# Altium project 智能车主板.PrjPcb
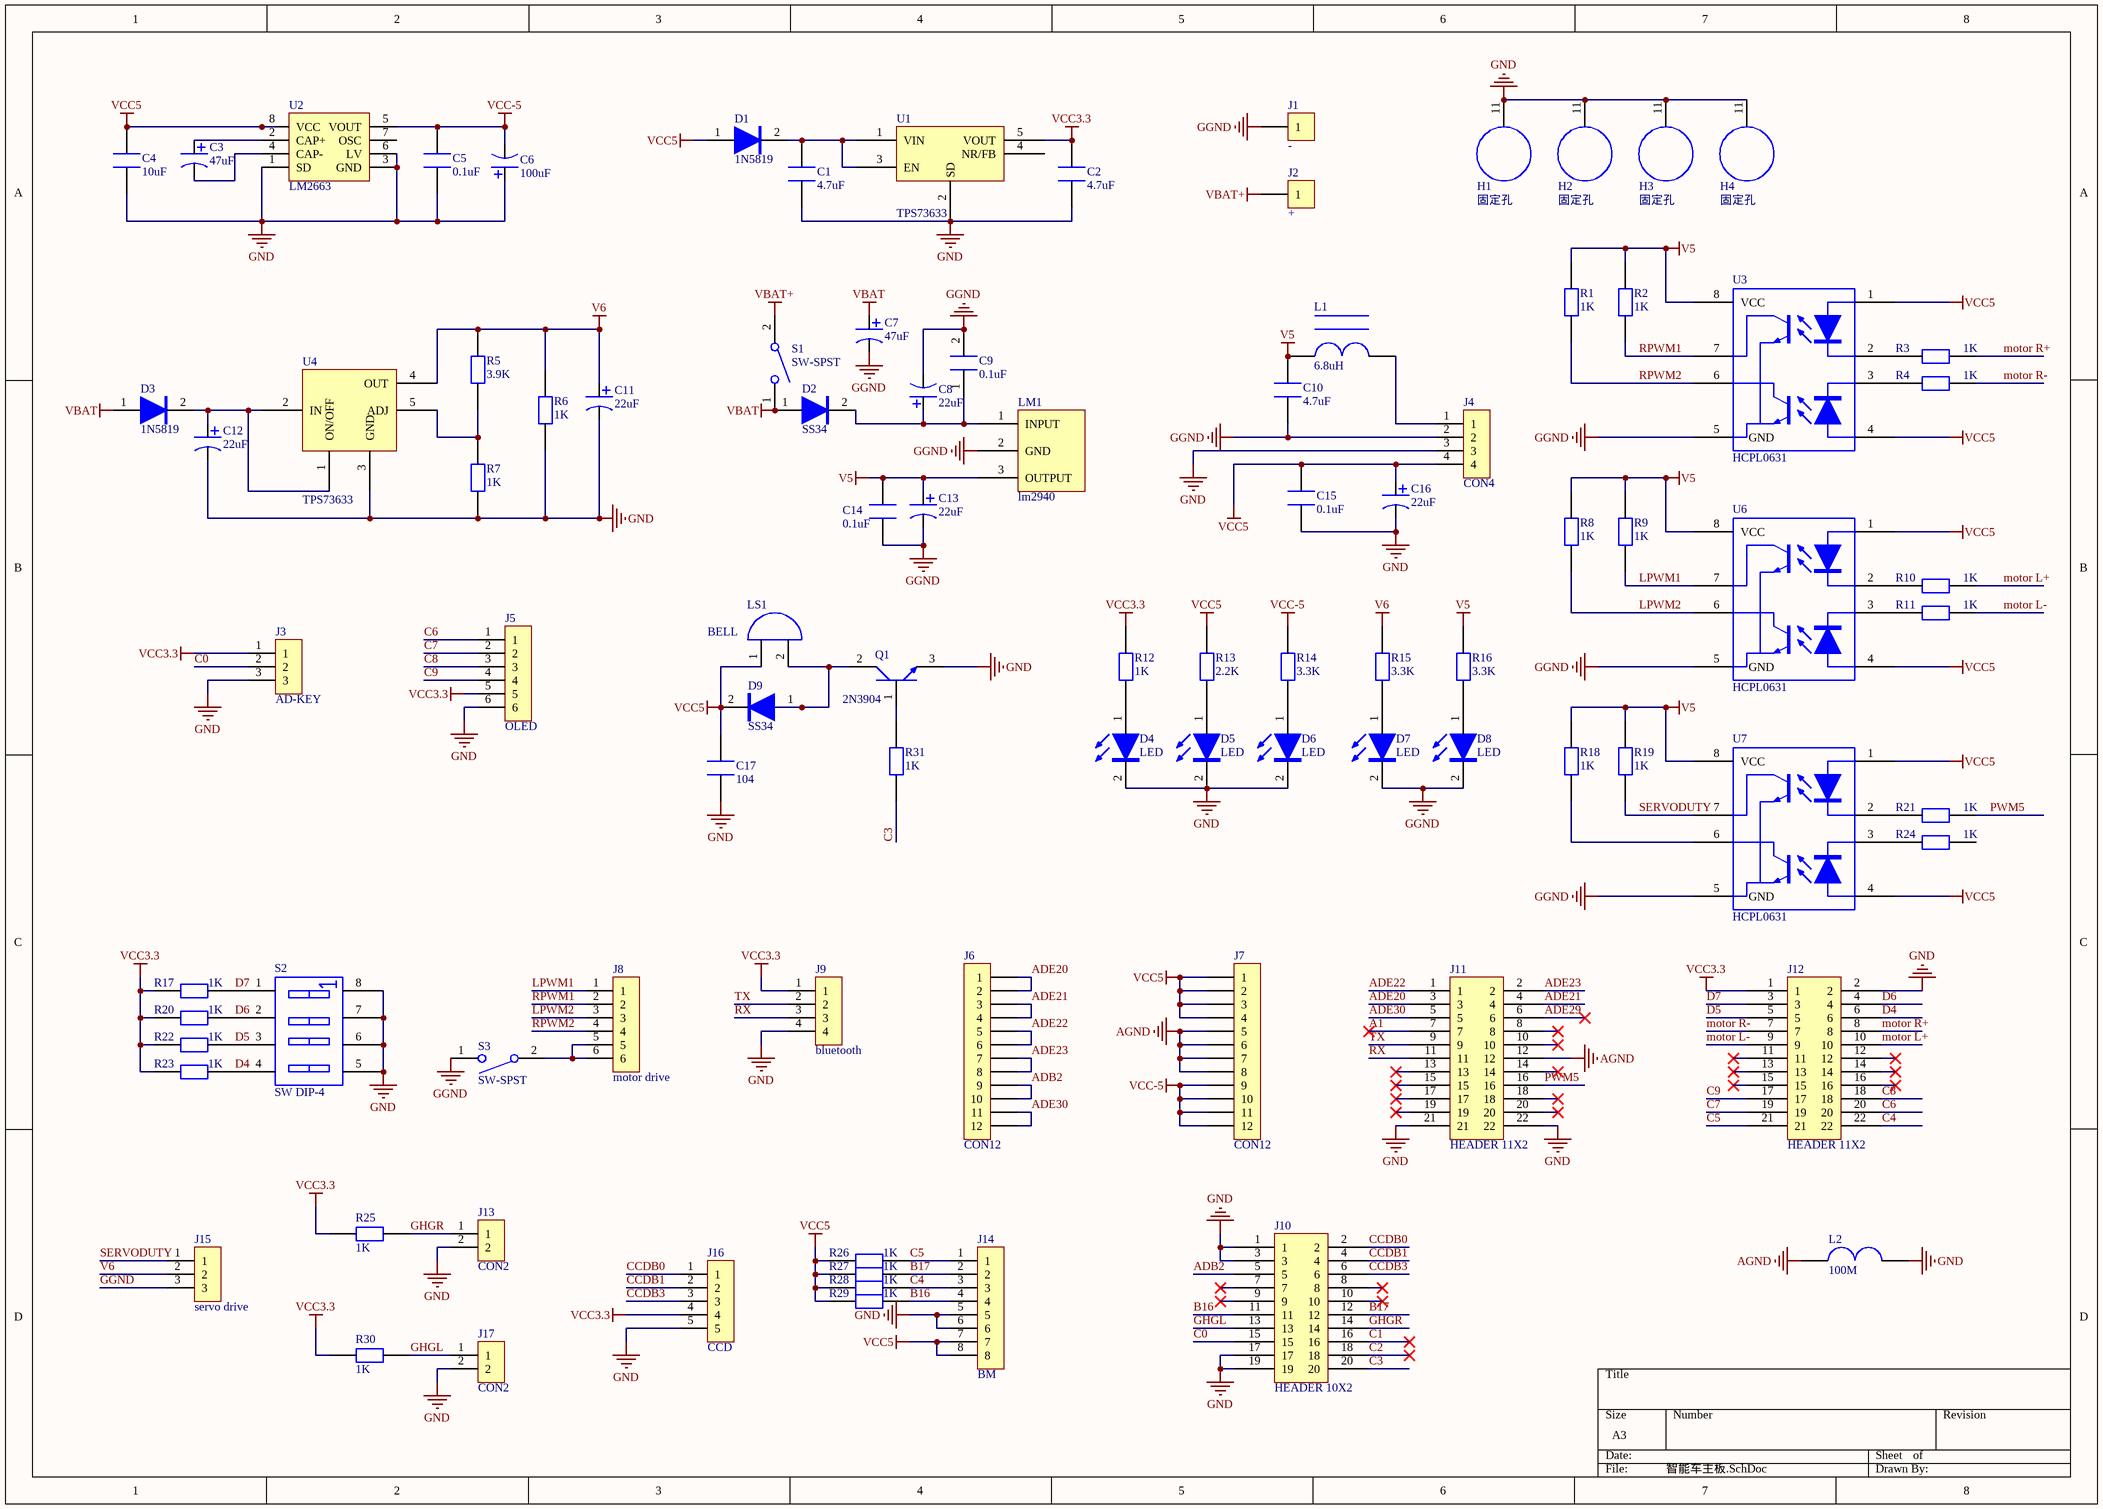
[diagram p0: 智能车主板.SchDoc]
1 sheet, 92 parts. Net scope: global (net labels, ports and power ports of the same name join across sheets).
Board file: 智能车主板.PcbDoc

## Sheet 智能车主板.SchDoc
size A3; SheetNumber: 1; SheetTotal: 1

### Parts
C1  4.7uF  [0805_Res]
C2  4.7uF  [0805_Res]
C3  47uF  [C型钽电容_6032_28]
C4  10uF  [0805_Res]
C5  0.1uF  [0805_Res]
C6  100uF  [D型钽电容_7343_31]
C7  47uF  [D型钽电容_7343_31]
C8  22uF  [C型钽电容_6032_28]
C9  0.1uF  [0805_Res]
C10  4.7uF  [0805_Res]
C11  22uF  [D型钽电容_7343_31]
C12  22uF  [D型钽电容_7343_31]
C13  22uF  [D型钽电容_7343_31]
C14  0.1uF  [0805_Res]
C15  0.1uF  [0805_Res]
C16  22uF  [D型钽电容_7343_31]
C17  104  [0805_RES]
D1  1N5819  [0805_Dio]
D2  SS34  [0805_Dio]
D3  1N5819  [0805_Dio]
D4  LED  [0805_Dio]
D5  LED  [0805_Dio]
D6  LED  [0805_Dio]
D7  LED  [0805_Dio]
D8  LED  [0805_Dio]
D9  SS34  [SS34_3D]
H1  固定孔  [铜柱孔3]
H2  固定孔  [铜柱孔3]
H3  固定孔  [铜柱孔3]
H4  固定孔  [铜柱孔3]
J1  -  [单面焊盘2*3MM_1PIN]
J2  +  [单面焊盘2*3MM_1PIN]
J3  AD-KEY  [HDR1X3]
J4  CON4  [B0505S-2W]
J5  OLED  [HDR1X6]
J6  CON12  [HDR2X6]
J7  CON12  [HDR2X6]
J8  motor drive  [HDR2X3]
J9  bluetooth  [HDR1X4]
J10  HEADER 10X2  [HDR2X10]
J11  HEADER 11X2  [HDR2X11]
J12  HEADER 11X2  [HDR2X11]
J13  CON2  [2PIN杜邦插座_1.27mm]
J14  BM  [HDR2X4]
J15  servo drive  [HDR1X3]
J16  CCD  [HDR1X5]
J17  CON2  [2PIN杜邦插座_1.27mm]
L1  6.8uH  [CDRH3D16_4.2*1.8]
L2  100M  [0603_Res]
LM1  lm2940  [SOT-223]
LS1  BELL  [蜂鸣器侧装]
Q1  2N3904  [TO-92A]
R1  1K  [0805_Res]
R2  1K  [0805_Res]
R3  1K  [0805_Res]
R4  1K  [0805_Res]
R5  3.9K  [0805_Res]
R6  1K  [0805_Res]
R7  1K  [0805_Res]
R8  1K  [0805_Res]
R9  1K  [0805_Res]
R10  1K  [0805_Res]
R11  1K  [0805_Res]
R12  1K  [0603_Res]
R13  2.2K  [0603_Res]
R14  3.3K  [0603_Res]
R15  3.3K  [0603_Res]
R16  3.3K  [0603_Res]
R17  1K  [0603_Res]
R18  1K  [0805_Res]
R19  1K  [0805_Res]
R20  1K  [0603_Res]
R21  1K  [0805_Res]
R22  1K  [0603_Res]
R23  1K  [0603_Res]
R24  1K  [0805_Res]
R25  1K  [0603_Res]
R26  1K  [0805_Res]
R27  1K  [0805_Res]
R28  1K  [0805_Res]
R29  1K  [0805_Res]
R30  1K  [0603_Res]
R31  1K  [0805_Res]
S1  SW-SPST  [开关]
S2  SW DIP-4  [4路拨码开关]
S3  SW-SPST  [开关]
U1  TPS73633  [SOT23_5-LEADS]
U2  LM2663  [SOP_8(OPA)]
U3  HCPL0631  [SOP_8(OPA)]
U4  TPS73633  [TO_263_5(10.5*8.4mm)]
U6  HCPL0631  [SOP_8(OPA)]
U7  HCPL0631  [SOP_8(OPA)]

### Nets
AGND: J7.5 J7.6 J7.7 J7.8 J11.12 L2.1
GGND: C7.2 C8.2 C9.2 C10.1 C13.2 C14.1 D7.2 D8.2 J1.1 J4.2 J15.3 LM1.2(GND) S3.1 U3.5(GND) U6.5(GND) U7.5(GND)
GND: C1.1 C2.1 C4.1 C5.1 C6.1 C11.2 C12.2 C15.1 C16.2 C17.1 D4.2 D5.2 D6.2 H1.11 H2.11 H3.11 H4.11 J3.3 J4.3 J5.6 J9.4 J10.1 J10.3 J10.17 J10.19 J11.21 J11.22 J12.2 J13.2 J14.5 J14.6 J16.5 J17.2 L2.2 Q1.3 R6.2 R7.2 S2.5 S2.6 S2.7 S2.8 U1.2(SD) U2.1(SD) U2.3(GND) U2.6(LV) U4.3(GND)
V5: C10.2 C13.1 C14.2 L1.1 LM1.3(OUTPUT) R1.2 R2.2 R8.2 R9.2 R16.2 R18.2 R19.2 U3.8(VCC) U6.8(VCC) U7.8(VCC)
V6: C11.1 J15.2 R5.1 R6.1 R15.2 U4.4(OUT)
VBAT: C7.1 D2.1 D3.1 S1.1
VBAT+: J2.1 S1.2
VCC3.3: C2.2 J3.1 J5.5 J9.1 J12.1 J16.4 R12.2 R17.2 R20.2 R22.2 R23.2 R25.1 R30.1 U1.5(VOUT)
VCC5: C4.2 C15.2 C16.1 C17.2 D1.1 D9.2 J4.4 J7.1 J7.2 J7.3 J7.4 J14.7 J14.8 LS1.1 R13.2 R26.1 R27.1 R28.1 R29.1 U2.8(VCC) U3.1 U3.4 U6.1 U6.4 U7.1 U7.4
VCC-5: C5.2 C6.2 J7.9 J7.10 J7.11 J7.12 R14.2 U2.5(VOUT)
A1: J11.7
ADB2: J6.9 J6.10 J10.5
ADE20: J6.1 J6.2 J11.3
ADE21: J6.3 J6.4 J11.4
ADE22: J6.5 J6.6 J11.1
ADE23: J6.7 J6.8 J11.2
ADE29: J11.6
ADE30: J6.11 J6.12 J11.5
B16: J10.11 J14.4 R29.2
B17: J10.12 J14.2 R27.2
C0: J3.2 J10.15
C1: J10.16
C2: J10.18
C3: J10.20 R31.1
C4: J12.22 J14.3 R28.2
C5: J12.21 J14.1 R26.2
C6: J5.1 J12.20
C7: J5.2 J12.19
C8: J5.3 J12.18
C9: J5.4 J12.17
CCDB0: J10.2 J16.1
CCDB1: J10.4 J16.2
CCDB3: J10.6 J16.3
D4: J12.6 R23.1 S2.4
D5: J12.5 R22.1 S2.3
D6: J12.4 R20.1 S2.2
D7: J12.3 R17.1 S2.1
GHGL: J10.13 J17.1 R30.2
GHGR: J10.14 J13.1 R25.2
LPWM1: J8.1 R9.1 U6.7
LPWM2: J8.3 R8.1 U6.6
motor L+: J12.10 R10.1
motor L-: J12.9 R11.1
motor R+: J12.8 R3.1
motor R-: J12.7 R4.1
PWM5: J11.16 R21.1
RPWM1: J8.2 R2.1 U3.7
RPWM2: J8.4 R1.1 U3.6
RX: J9.3 J11.11
SERVODUTY: J15.1 R19.1 U7.7
TX: J9.2 J11.9
NetC1_2: C1.2 D1.2 U1.1(VIN) U1.3(EN)
NetC3_1: C3.1 U2.2(CAP+)
NetC3_2: C3.2 U2.4(CAP-)
NetC8_1: C8.1 C9.1 D2.2 LM1.1(INPUT)
NetC12_1: C12.1 D3.2 U4.1(ON/OFF) U4.2(IN)
NetD4_1: D4.1 R12.1
NetD5_1: D5.1 R13.1
NetD6_1: D6.1 R14.1
NetD7_1: D7.1 R15.1
NetD8_1: D8.1 R16.1
NetD9_1: D9.1 LS1.2 Q1.2
NetJ4_1: J4.1 L1.2
NetJ8_5: J8.5 J8.6 S3.2
NetQ1_1: Q1.1 R31.2
NetR3_2: R3.2 U3.2
NetR4_2: R4.2 U3.3
NetR5_2: R5.2 R7.1 U4.5(ADJ)
NetR10_2: R10.2 U6.2
NetR11_2: R11.2 U6.3
NetR18_1: R18.1 U7.6
NetR21_2: R21.2 U7.2
NetR24_2: R24.2 U7.3

Not connected (* = marked no-connect by the designer): J10 7* 8* 9* 10*; J11 8* 10* 13* 14* 15* 17* 18* 19* 20*; J12 11* 12* 13* 14* 15* 16*; R24 1; U1 4(NR/FB); U2 7(OSC)

### Library data of the parts
C1 C2 C4 C5 C9 C10 C14 C15 C17 = CAP: 电容
C3 C6-C8 C11-C13 C16 = 极性电容
D1-D3 D9 = SS34: 二极管
D4-D8 = LED: LED灯
J1 J2 = CON1: 排针
J3 J15 = CON3: 排针
J4 J9 = CON4: 排针
J5 J8 = CON6: 排针
J6 J7 = CON12: 排针
J10 = HEADER 10X2: 排针
J11 J12 = HEADER 11X2: 排针
J13 J17 = CON2: 排针
J14 = CON8: 排针
J16 = CON5: 排针
L1 = INDUCTOR: 电感
L2 = INDUCTOR_2: 电感
LM1 = lm2940: IC
LS1 = BELL: 喇叭
Q1 = 2N3904: 三极管
R1-R31 = RES: 电阻
S1 S3 = SW-SPST: 开关
S2 = SW DIP-4: 拨码开关
U1 = TPS73633: IC
U2 = LM2663: IC
U3 U6 U7 = HCPL0631: 光耦
U4 = MIC29302: IC